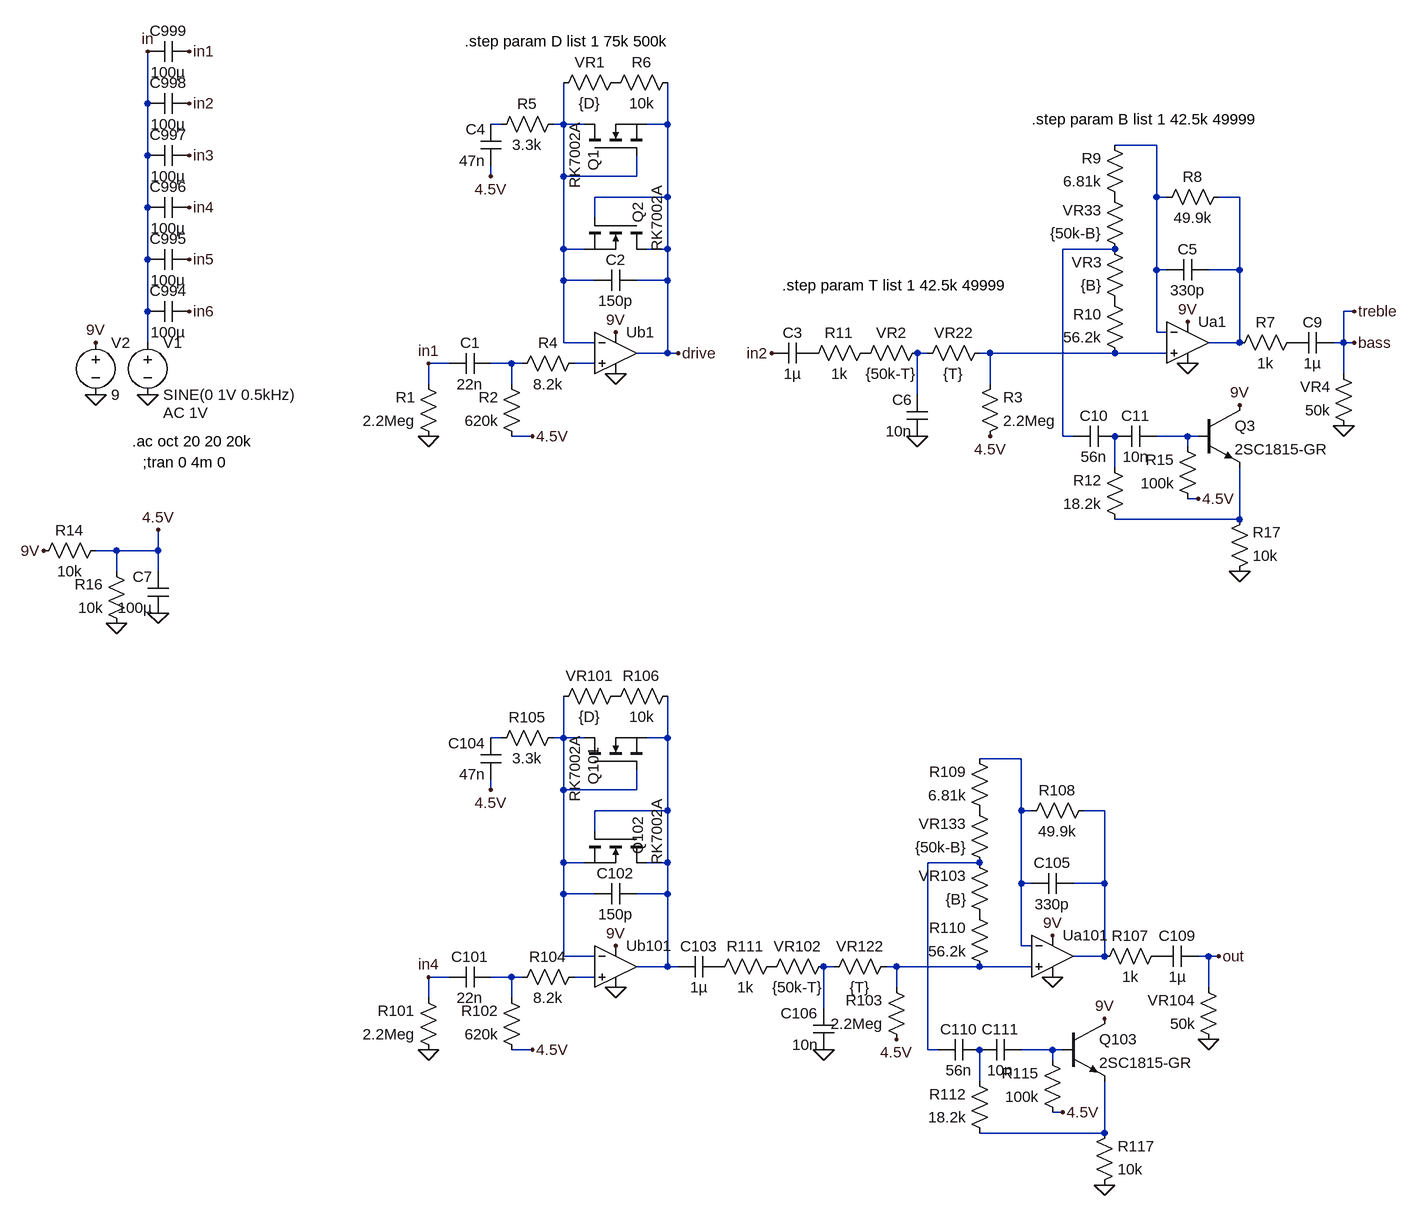
[diagram p0: schematic ray.asc]
ray.asc, the LTspice schematic file:
Version 4
SHEET 1 3148 3460
WIRE -1568 704 -1568 624
WIRE -1024 736 -1040 736
WIRE -928 736 -928 672
WIRE -928 736 -944 736
WIRE -896 736 -928 736
WIRE -768 736 -768 672
WIRE -768 736 -800 736
WIRE -16 768 -80 768
WIRE -1568 784 -1568 704
WIRE -1040 816 -1040 800
WIRE -928 816 -928 736
WIRE -816 816 -816 784
WIRE -816 816 -928 816
WIRE -768 848 -768 736
WIRE -768 848 -880 848
WIRE -16 848 -16 768
WIRE 0 848 -16 848
WIRE 112 848 80 848
WIRE -1568 864 -1568 784
WIRE -880 880 -880 848
WIRE -928 928 -928 816
WIRE -896 928 -928 928
WIRE -768 928 -768 848
WIRE -768 928 -800 928
WIRE -80 928 -160 928
WIRE -1568 944 -1568 864
WIRE -16 960 -16 848
WIRE 0 960 -16 960
WIRE 112 960 112 848
WIRE 112 960 64 960
WIRE -928 976 -928 928
WIRE -880 976 -928 976
WIRE -768 976 -768 928
WIRE -768 976 -816 976
WIRE -1568 1024 -1568 944
WIRE 288 1024 272 1024
WIRE -16 1056 -16 960
WIRE 0 1056 -16 1056
WIRE -1568 1072 -1568 1024
WIRE -928 1072 -928 976
WIRE -880 1072 -928 1072
WIRE 112 1072 112 960
WIRE 112 1072 64 1072
WIRE 272 1072 272 1024
WIRE 272 1072 256 1072
WIRE 288 1072 272 1072
WIRE -768 1088 -768 976
WIRE -768 1088 -816 1088
WIRE -752 1088 -768 1088
WIRE -368 1088 -384 1088
WIRE -272 1088 -288 1088
WIRE -80 1088 -272 1088
WIRE 0 1088 -80 1088
WIRE -1104 1104 -1136 1104
WIRE -1008 1104 -1040 1104
WIRE -992 1104 -1008 1104
WIRE -880 1104 -912 1104
WIRE 272 1120 272 1072
WIRE -1136 1136 -1136 1104
WIRE -1008 1136 -1008 1104
WIRE -272 1136 -272 1088
WIRE -384 1152 -384 1088
WIRE -976 1216 -1008 1216
WIRE -160 1216 -160 928
WIRE -144 1216 -160 1216
WIRE 32 1216 -16 1216
WIRE 48 1216 32 1216
WIRE 32 1232 32 1216
WIRE -80 1264 -80 1216
WIRE 48 1312 32 1312
WIRE 112 1344 112 1264
WIRE 112 1344 -80 1344
WIRE -1616 1392 -1648 1392
WIRE -1552 1392 -1552 1360
WIRE -1552 1392 -1616 1392
WIRE -1616 1424 -1616 1392
WIRE -1552 1424 -1552 1392
WIRE -1024 1680 -1040 1680
WIRE -928 1680 -928 1616
WIRE -928 1680 -944 1680
WIRE -896 1680 -928 1680
WIRE -768 1680 -768 1616
WIRE -768 1680 -800 1680
WIRE -224 1712 -288 1712
WIRE -1040 1760 -1040 1744
WIRE -928 1760 -928 1680
WIRE -816 1760 -816 1728
WIRE -816 1760 -928 1760
WIRE -768 1792 -768 1680
WIRE -768 1792 -880 1792
WIRE -224 1792 -224 1712
WIRE -208 1792 -224 1792
WIRE -96 1792 -128 1792
WIRE -880 1824 -880 1792
WIRE -928 1872 -928 1760
WIRE -896 1872 -928 1872
WIRE -768 1872 -768 1792
WIRE -768 1872 -800 1872
WIRE -288 1872 -368 1872
WIRE -224 1904 -224 1792
WIRE -208 1904 -224 1904
WIRE -96 1904 -96 1792
WIRE -96 1904 -144 1904
WIRE -928 1920 -928 1872
WIRE -880 1920 -928 1920
WIRE -768 1920 -768 1872
WIRE -768 1920 -816 1920
WIRE -224 2000 -224 1904
WIRE -208 2000 -224 2000
WIRE -928 2016 -928 1920
WIRE -880 2016 -928 2016
WIRE -96 2016 -96 1904
WIRE -96 2016 -144 2016
WIRE 64 2016 48 2016
WIRE 80 2016 64 2016
WIRE -768 2032 -768 1920
WIRE -768 2032 -816 2032
WIRE -752 2032 -768 2032
WIRE -512 2032 -528 2032
WIRE -416 2032 -432 2032
WIRE -288 2032 -416 2032
WIRE -208 2032 -288 2032
WIRE -1104 2048 -1136 2048
WIRE -1008 2048 -1040 2048
WIRE -992 2048 -1008 2048
WIRE -880 2048 -912 2048
WIRE -416 2064 -416 2032
WIRE 64 2064 64 2016
WIRE -1136 2080 -1136 2048
WIRE -1008 2080 -1008 2048
WIRE -528 2096 -528 2032
WIRE -976 2160 -1008 2160
WIRE -368 2160 -368 1872
WIRE -352 2160 -368 2160
WIRE -176 2160 -224 2160
WIRE -160 2160 -176 2160
WIRE -176 2176 -176 2160
WIRE -288 2208 -288 2160
WIRE -160 2256 -176 2256
WIRE -96 2288 -96 2208
WIRE -96 2288 -288 2288
FLAG -1568 1152 0
FLAG -1568 624 in
FLAG -1648 1152 0
FLAG -1648 1072 9V
FLAG -1504 624 in1
FLAG -1504 704 in2
FLAG -1504 784 in3
FLAG -1504 864 in4
FLAG -1504 944 in5
FLAG -1504 1024 in6
FLAG -848 1056 9V
FLAG -848 1120 0
FLAG -1136 1216 0
FLAG -1552 1488 0
FLAG -1616 1504 0
FLAG -1728 1392 9V
FLAG -1552 1360 4.5V
FLAG -976 1216 4.5V
FLAG -384 1216 0
FLAG 32 1104 0
FLAG 32 1040 9V
FLAG 272 1200 0
FLAG -1136 1104 in1
FLAG -608 1088 in2
FLAG -752 1088 drive
FLAG -272 1216 4.5V
FLAG 288 1024 treble
FLAG 288 1072 bass
FLAG -1040 816 4.5V
FLAG 48 1312 4.5V
FLAG 112 1168 9V
FLAG 112 1424 0
FLAG -848 2000 9V
FLAG -848 2064 0
FLAG -1136 2160 0
FLAG -976 2160 4.5V
FLAG -528 2160 0
FLAG -176 2048 0
FLAG -176 1984 9V
FLAG 64 2144 0
FLAG -416 2144 4.5V
FLAG 80 2016 out
FLAG -1040 1760 4.5V
FLAG -160 2256 4.5V
FLAG -96 2112 9V
FLAG -96 2368 0
FLAG -1136 2048 in4
SYMBOL voltage -1568 1056 R0
WINDOW 123 24 124 Left 2
WINDOW 39 0 0 Left 2
SYMATTR Value2 AC 1V
SYMATTR InstName V1
SYMATTR Value SINE(0 1V 0.5kHz)
SYMBOL voltage -1648 1056 R0
WINDOW 123 0 0 Left 0
WINDOW 39 0 0 Left 0
SYMATTR InstName V2
SYMATTR Value 9
SYMBOL Opamps\\UniversalOpamp2 -848 1088 R0
SYMATTR InstName Ub1
SYMBOL Opamps\\UniversalOpamp2 32 1072 R0
SYMATTR InstName Ua1
SYMBOL cap -1504 688 R90
WINDOW 0 0 32 VBottom 2
WINDOW 3 32 32 VTop 2
SYMATTR InstName C998
SYMATTR Value 100µ
SYMBOL cap -1504 768 R90
WINDOW 0 0 32 VBottom 2
WINDOW 3 32 32 VTop 2
SYMATTR InstName C997
SYMATTR Value 100µ
SYMBOL cap -1504 848 R90
WINDOW 0 0 32 VBottom 2
WINDOW 3 32 32 VTop 2
SYMATTR InstName C996
SYMATTR Value 100µ
SYMBOL cap -1504 608 R90
WINDOW 0 0 32 VBottom 2
WINDOW 3 32 32 VTop 2
SYMATTR InstName C999
SYMATTR Value 100µ
SYMBOL cap -1504 928 R90
WINDOW 0 0 32 VBottom 2
WINDOW 3 32 32 VTop 2
SYMATTR InstName C995
SYMATTR Value 100µ
SYMBOL cap -1504 1008 R90
WINDOW 0 0 32 VBottom 2
WINDOW 3 32 32 VTop 2
SYMATTR InstName C994
SYMATTR Value 100µ
SYMBOL cap -1040 1088 R90
WINDOW 0 0 32 VBottom 2
WINDOW 3 32 32 VTop 2
SYMATTR InstName C1
SYMATTR Value 22n
SYMBOL cap -544 1072 R90
WINDOW 0 0 32 VBottom 2
WINDOW 3 32 32 VTop 2
SYMATTR InstName C3
SYMATTR Value 1µ
SYMBOL cap -1024 800 R180
WINDOW 0 24 56 Left 2
WINDOW 3 24 8 Left 2
SYMATTR InstName C4
SYMATTR Value 47n
SYMBOL cap -368 1216 R180
WINDOW 0 24 56 Left 2
WINDOW 3 24 8 Left 2
SYMATTR InstName C6
SYMATTR Value 10n
SYMBOL cap -816 960 R90
WINDOW 0 0 32 VBottom 2
WINDOW 3 32 32 VTop 2
SYMATTR InstName C2
SYMATTR Value 150p
SYMBOL cap 192 1088 R270
WINDOW 0 32 32 VTop 2
WINDOW 3 0 32 VBottom 2
SYMATTR InstName C9
SYMATTR Value 1µ
SYMBOL cap -1536 1488 R180
WINDOW 0 24 56 Left 2
WINDOW 3 24 8 Left 2
SYMATTR InstName C7
SYMATTR Value 100µ
SYMBOL res -752 656 R90
WINDOW 0 0 56 VBottom 2
WINDOW 3 32 56 VTop 2
SYMATTR InstName R6
SYMATTR Value 10k
SYMBOL res -992 1232 R180
WINDOW 0 36 76 Left 2
WINDOW 3 36 40 Left 2
SYMATTR InstName R2
SYMATTR Value 620k
SYMBOL res -1120 1232 R180
WINDOW 0 36 76 Left 2
WINDOW 3 36 40 Left 2
SYMATTR InstName R1
SYMATTR Value 2.2Meg
SYMBOL res -928 720 R90
WINDOW 0 0 56 VBottom 2
WINDOW 3 32 56 VTop 2
SYMATTR InstName R5
SYMATTR Value 3.3k
SYMBOL res 96 832 R90
WINDOW 0 0 56 VBottom 2
WINDOW 3 32 56 VTop 2
SYMATTR InstName R8
SYMATTR Value 49.9k
SYMBOL res -64 864 R180
WINDOW 0 36 76 Left 2
WINDOW 3 36 40 Left 2
SYMATTR InstName R9
SYMATTR Value 6.81k
SYMBOL res 208 1056 R90
WINDOW 0 0 56 VBottom 2
WINDOW 3 32 56 VTop 2
SYMATTR InstName R7
SYMATTR Value 1k
SYMBOL res 288 1216 R180
WINDOW 0 36 76 Left 2
WINDOW 3 36 40 Left 2
SYMATTR InstName VR4
SYMATTR Value 50k
SYMBOL res -64 1104 R180
WINDOW 0 36 76 Left 2
WINDOW 3 36 40 Left 2
SYMATTR InstName R10
SYMATTR Value 56.2k
SYMBOL res -448 1072 R90
WINDOW 0 0 56 VBottom 2
WINDOW 3 32 56 VTop 2
SYMATTR InstName R11
SYMATTR Value 1k
SYMBOL res -1632 1376 R90
WINDOW 0 0 56 VBottom 2
WINDOW 3 32 56 VTop 2
SYMATTR InstName R14
SYMATTR Value 10k
SYMBOL res -1600 1520 R180
WINDOW 0 36 76 Left 2
WINDOW 3 36 40 Left 2
SYMATTR InstName R16
SYMATTR Value 10k
SYMBOL res -288 1232 M180
WINDOW 0 36 76 Left 2
WINDOW 3 36 40 Left 2
SYMATTR InstName R3
SYMATTR Value 2.2Meg
SYMBOL res -832 656 R90
WINDOW 0 0 56 VBottom 2
WINDOW 3 32 56 VTop 2
SYMATTR InstName VR1
SYMATTR Value {D}
SYMBOL res -368 1072 R90
WINDOW 0 0 56 VBottom 2
WINDOW 3 32 56 VTop 2
SYMATTR InstName VR2
SYMATTR Value {50k-T}
SYMBOL res -272 1072 R90
WINDOW 0 0 56 VBottom 2
WINDOW 3 32 56 VTop 2
SYMATTR InstName VR22
SYMATTR Value {T}
SYMBOL res -64 1024 R180
WINDOW 0 36 76 Left 2
WINDOW 3 36 40 Left 2
SYMATTR InstName VR3
SYMATTR Value {B}
SYMBOL res -896 1088 R90
WINDOW 0 0 56 VBottom 2
WINDOW 3 32 56 VTop 2
SYMATTR InstName R4
SYMATTR Value 8.2k
SYMBOL cap 64 944 R90
WINDOW 0 0 32 VBottom 2
WINDOW 3 32 32 VTop 2
SYMATTR InstName C5
SYMATTR Value 330p
SYMBOL npn 48 1168 R0
SYMATTR InstName Q3
SYMATTR Value 2SC1815-GR
SYMBOL cap -80 1200 R90
WINDOW 0 0 32 VBottom 2
WINDOW 3 32 32 VTop 2
SYMATTR InstName C10
SYMATTR Value 56n
SYMBOL cap -16 1200 R90
WINDOW 0 0 32 VBottom 2
WINDOW 3 32 32 VTop 2
SYMATTR InstName C11
SYMATTR Value 10n
SYMBOL res 48 1328 R180
WINDOW 0 36 76 Left 2
WINDOW 3 36 40 Left 2
SYMATTR InstName R15
SYMATTR Value 100k
SYMBOL res 96 1440 M180
WINDOW 0 36 76 Left 2
WINDOW 3 36 40 Left 2
SYMATTR InstName R17
SYMATTR Value 10k
SYMBOL res -64 1360 R180
WINDOW 0 36 76 Left 2
WINDOW 3 36 40 Left 2
SYMATTR InstName R12
SYMATTR Value 18.2k
SYMBOL res -64 944 R180
WINDOW 0 36 76 Left 2
WINDOW 3 36 40 Left 2
SYMATTR InstName VR33
SYMATTR Value {50k-B}
SYMBOL Opamps\\UniversalOpamp2 -848 2032 R0
SYMATTR InstName Ub101
SYMBOL Opamps\\UniversalOpamp2 -176 2016 R0
SYMATTR InstName Ua101
SYMBOL cap -1040 2032 R90
WINDOW 0 0 32 VBottom 2
WINDOW 3 32 32 VTop 2
SYMATTR InstName C101
SYMATTR Value 22n
SYMBOL cap -688 2016 R90
WINDOW 0 0 32 VBottom 2
WINDOW 3 32 32 VTop 2
SYMATTR InstName C103
SYMATTR Value 1µ
SYMBOL cap -1024 1744 R180
WINDOW 0 24 56 Left 2
WINDOW 3 24 8 Left 2
SYMATTR InstName C104
SYMATTR Value 47n
SYMBOL cap -512 2160 R180
WINDOW 0 24 56 Left 2
WINDOW 3 24 8 Left 2
SYMATTR InstName C106
SYMATTR Value 10n
SYMBOL cap -816 1904 R90
WINDOW 0 0 32 VBottom 2
WINDOW 3 32 32 VTop 2
SYMATTR InstName C102
SYMATTR Value 150p
SYMBOL cap -16 2032 R270
WINDOW 0 32 32 VTop 2
WINDOW 3 0 32 VBottom 2
SYMATTR InstName C109
SYMATTR Value 1µ
SYMBOL res -752 1600 R90
WINDOW 0 0 56 VBottom 2
WINDOW 3 32 56 VTop 2
SYMATTR InstName R106
SYMATTR Value 10k
SYMBOL res -992 2176 R180
WINDOW 0 36 76 Left 2
WINDOW 3 36 40 Left 2
SYMATTR InstName R102
SYMATTR Value 620k
SYMBOL res -1120 2176 R180
WINDOW 0 36 76 Left 2
WINDOW 3 36 40 Left 2
SYMATTR InstName R101
SYMATTR Value 2.2Meg
SYMBOL res -928 1664 R90
WINDOW 0 0 56 VBottom 2
WINDOW 3 32 56 VTop 2
SYMATTR InstName R105
SYMATTR Value 3.3k
SYMBOL res -112 1776 R90
WINDOW 0 0 56 VBottom 2
WINDOW 3 32 56 VTop 2
SYMATTR InstName R108
SYMATTR Value 49.9k
SYMBOL res -272 1808 R180
WINDOW 0 36 76 Left 2
WINDOW 3 36 40 Left 2
SYMATTR InstName R109
SYMATTR Value 6.81k
SYMBOL res 0 2000 R90
WINDOW 0 0 56 VBottom 2
WINDOW 3 32 56 VTop 2
SYMATTR InstName R107
SYMATTR Value 1k
SYMBOL res 80 2160 R180
WINDOW 0 36 76 Left 2
WINDOW 3 36 40 Left 2
SYMATTR InstName VR104
SYMATTR Value 50k
SYMBOL res -272 2048 R180
WINDOW 0 36 76 Left 2
WINDOW 3 36 40 Left 2
SYMATTR InstName R110
SYMATTR Value 56.2k
SYMBOL res -592 2016 R90
WINDOW 0 0 56 VBottom 2
WINDOW 3 32 56 VTop 2
SYMATTR InstName R111
SYMATTR Value 1k
SYMBOL res -832 1600 R90
WINDOW 0 0 56 VBottom 2
WINDOW 3 32 56 VTop 2
SYMATTR InstName VR101
SYMATTR Value {D}
SYMBOL res -512 2016 R90
WINDOW 0 0 56 VBottom 2
WINDOW 3 32 56 VTop 2
SYMATTR InstName VR102
SYMATTR Value {50k-T}
SYMBOL res -416 2016 R90
WINDOW 0 0 56 VBottom 2
WINDOW 3 32 56 VTop 2
SYMATTR InstName VR122
SYMATTR Value {T}
SYMBOL res -272 1968 R180
WINDOW 0 36 76 Left 2
WINDOW 3 36 40 Left 2
SYMATTR InstName VR103
SYMATTR Value {B}
SYMBOL res -400 2160 R180
WINDOW 0 36 76 Left 2
WINDOW 3 36 40 Left 2
SYMATTR InstName R103
SYMATTR Value 2.2Meg
SYMBOL res -896 2032 R90
WINDOW 0 0 56 VBottom 2
WINDOW 3 32 56 VTop 2
SYMATTR InstName R104
SYMATTR Value 8.2k
SYMBOL cap -144 1888 R90
WINDOW 0 0 32 VBottom 2
WINDOW 3 32 32 VTop 2
SYMATTR InstName C105
SYMATTR Value 330p
SYMBOL npn -160 2112 R0
SYMATTR InstName Q103
SYMATTR Value 2SC1815-GR
SYMBOL cap -288 2144 R90
WINDOW 0 0 32 VBottom 2
WINDOW 3 32 32 VTop 2
SYMATTR InstName C110
SYMATTR Value 56n
SYMBOL cap -224 2144 R90
WINDOW 0 0 32 VBottom 2
WINDOW 3 32 32 VTop 2
SYMATTR InstName C111
SYMATTR Value 10n
SYMBOL res -160 2272 R180
WINDOW 0 36 76 Left 2
WINDOW 3 36 40 Left 2
SYMATTR InstName R115
SYMATTR Value 100k
SYMBOL res -112 2384 M180
WINDOW 0 36 76 Left 2
WINDOW 3 36 40 Left 2
SYMATTR InstName R117
SYMATTR Value 10k
SYMBOL res -272 2304 R180
WINDOW 0 36 76 Left 2
WINDOW 3 36 40 Left 2
SYMATTR InstName R112
SYMATTR Value 18.2k
SYMBOL res -272 1888 R180
WINDOW 0 36 76 Left 2
WINDOW 3 36 40 Left 2
SYMATTR InstName VR133
SYMATTR Value {50k-B}
SYMBOL nmos -896 1728 R270
WINDOW 0 -24 14 Left 2
WINDOW 3 -51 -15 Left 2
SYMATTR InstName Q101
SYMATTR Value RK7002A
SYMBOL nmos -800 1824 R90
WINDOW 0 -24 14 Left 2
WINDOW 3 -51 -15 Left 2
SYMATTR InstName Q102
SYMATTR Value RK7002A
SYMBOL nmos -896 784 R270
WINDOW 0 -24 14 Left 2
WINDOW 3 -51 -15 Left 2
SYMATTR InstName Q1
SYMATTR Value RK7002A
SYMBOL nmos -800 880 R90
WINDOW 0 -24 14 Left 2
WINDOW 3 -51 -15 Left 2
SYMATTR InstName Q2
SYMATTR Value RK7002A
TEXT -1592 1224 Left 2 !.ac oct 20 20 20k
TEXT -1576 1256 Left 2 !;tran 0 4m 0
TEXT -592 984 Left 2 !.step param T list 1 42.5k 49999
TEXT -1080 608 Left 2 !.step param D list 1 75k 500k
TEXT -208 728 Left 2 !.step param B list 1 42.5k 49999

The netlist it stands for:
* ray.asc
V1 in 0 SINE(0 1V 0.5kHz) AC 1V
V2 9V 0 9
XUb1 N009 N002 9V 0 drive level.2 Avol=1Meg GBW=10Meg Slew=10Meg ilimit=25m rail=0 Vos=0 phimargin=45 en=0 enk=0 in=0 ink=0 Rin=500Meg  ; pins IN+ IN- V+ V- OUT
XUa1 N007 N003 9V 0 N004 level.2 Avol=1Meg GBW=10Meg Slew=10Meg ilimit=25m rail=0 Vos=0 phimargin=45 en=0 enk=0 in=0 ink=0 Rin=500Meg  ; pins IN+ IN- V+ V- OUT
C998 in2 in 100µ
C997 in3 in 100µ
C996 in4 in 100µ
C999 in1 in 100µ
C995 in5 in 100µ
C994 in6 in 100µ
C1 N008 in1 22n
C3 P001 in2 1µ
C4 4.5V N001 47n
C6 0 N006 10n
C2 drive N002 150p
C9 P002 bass 1µ
C7 0 4.5V 100µ
R6 drive P003 10k
R2 4.5V N008 620k
R1 0 in1 2.2Meg
R5 N002 N001 3.3k
R8 N004 N003 49.9k
R9 P004 N003 6.81k
R7 P002 N004 1k
R§VR4 0 bass 50k
R10 N007 P005 56.2k
R11 P006 P001 1k
R14 4.5V 9V 10k
R16 0 4.5V 10k
R3 4.5V N007 2.2Meg
R§VR1 P003 N002 {D}
R§VR2 N006 P006 {50k-T}
R§VR22 N007 N006 {T}
R§VR3 P005 N005 {B}
R4 N009 N008 8.2k
C5 N004 N003 330p
Q3 9V N010 N012 0 2SC1815-GR
C10 N011 N005 56n
C11 N010 N011 10n
R15 4.5V N010 100k
R17 0 N012 10k
R12 N012 N011 18.2k
R§VR33 N005 P004 {50k-B}
XUb101 N022 N014 9V 0 N015 level.2 Avol=1Meg GBW=10Meg Slew=10Meg ilimit=25m rail=0 Vos=0 phimargin=45 en=0 enk=0 in=0 ink=0 Rin=500Meg  ; pins IN+ IN- V+ V- OUT
XUa101 N020 N016 9V 0 N017 level.2 Avol=1Meg GBW=10Meg Slew=10Meg ilimit=25m rail=0 Vos=0 phimargin=45 en=0 enk=0 in=0 ink=0 Rin=500Meg  ; pins IN+ IN- V+ V- OUT
C101 N021 in4 22n
C103 P007 N015 1µ
C104 4.5V N013 47n
C106 0 N019 10n
C102 N015 N014 150p
C109 P008 out 1µ
R106 N015 P009 10k
R102 4.5V N021 620k
R101 0 in4 2.2Meg
R105 N014 N013 3.3k
R108 N017 N016 49.9k
R109 P010 N016 6.81k
R107 P008 N017 1k
R§VR104 0 out 50k
R110 N020 P011 56.2k
R111 P012 P007 1k
R§VR101 P009 N014 {D}
R§VR102 N019 P012 {50k-T}
R§VR122 N020 N019 {T}
R§VR103 P011 N018 {B}
R103 4.5V N020 2.2Meg
R104 N022 N021 8.2k
C105 N017 N016 330p
Q103 9V N023 N025 0 2SC1815-GR
C110 N024 N018 56n
C111 N023 N024 10n
R115 4.5V N023 100k
R117 0 N025 10k
R112 N025 N024 18.2k
R§VR133 N018 P010 {50k-B}
M§Q101 N014 N014 N015 N015 RK7002A
M§Q102 N015 N015 N014 N014 RK7002A
M§Q1 N002 N002 drive drive RK7002A
M§Q2 drive drive N002 N002 RK7002A
.model NPN NPN
.model PNP PNP
.lib standard.bjt
.model NMOS NMOS
.model PMOS PMOS
.lib standard.mos
.ac oct 20 20 20k
;tran 0 4m 0
.step param T list 1 42.5k 49999
.step param D list 1 75k 500k
.step param B list 1 42.5k 49999
.lib UniversalOpamps2.sub
.backanno
.end